# EAGLE design main (EAGLE 6.1)
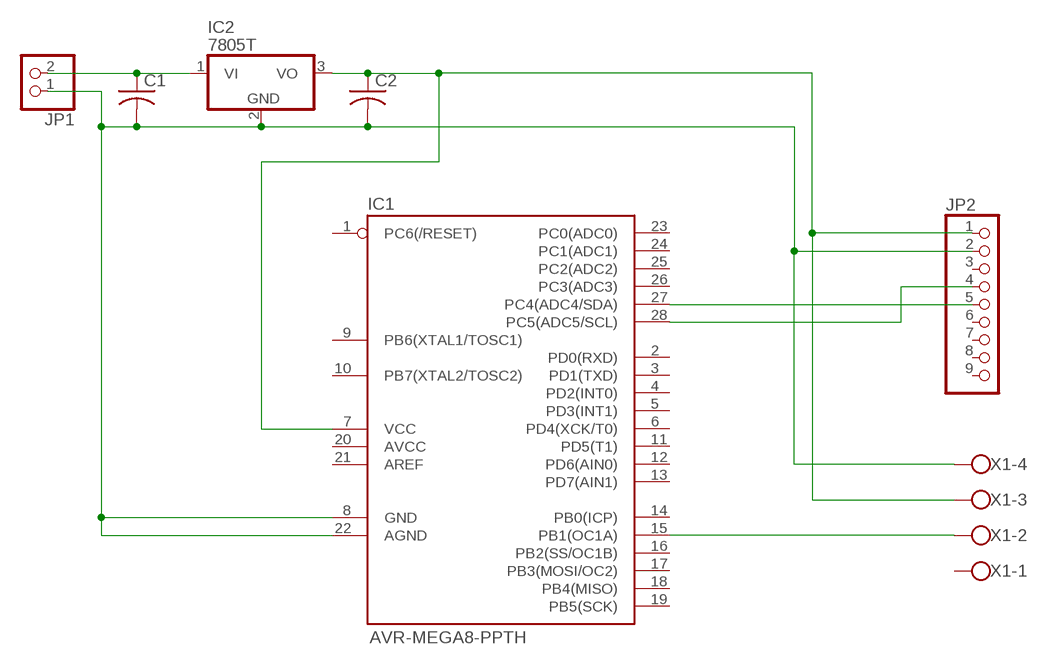
[diagram p0: schematic, sheet 1]

## Parts
C1  C-US050-075X075  [C050-075X075]
C2  C-US025-050X050  [C025-050X050]
IC1  AVR-MEGA8-PPTH  [DIL28-3]
IC2  7805T  [TO220H]
JP1  PINHD-1X2  [1X02]
JP2  PINHD-1X9  [1X09]
X1  W237-4  [W237-4]

## Nets
N$1: C1.1 IC2.1(VI) JP1.2
N$2: C1.2 C2.2 IC1.8(GND) IC1.22(AGND) IC2.2(GND) JP1.1 JP2.2 X1.4
N$3: C2.1 IC1.7(VCC) IC2.3(VO) JP2.1 X1.3
N$4: IC1.28(PC5(ADC5/SCL)) JP2.4
N$5: IC1.27(PC4(ADC4/SDA)) JP2.5
N$6: IC1.15(PB1(OC1A)) X1.2
Unconnected: IC1.1(PC6(/RESET)) IC1.2(PD0(RXD)) IC1.3(PD1(TXD)) IC1.4(PD2(INT0)) IC1.5(PD3(INT1)) IC1.6(PD4(XCK/T0)) IC1.9(PB6(XTAL1/TOSC1)) IC1.10(PB7(XTAL2/TOSC2)) IC1.11(PD5(T1)) IC1.12(PD6(AIN0)) IC1.13(PD7(AIN1)) IC1.14(PB0(ICP)) IC1.16(PB2(SS/OC1B)) IC1.17(PB3(MOSI/OC2)) IC1.18(PB4(MISO)) IC1.19(PB5(SCK)) IC1.20(AVCC) IC1.21(AREF) IC1.23(PC0(ADC0)) IC1.24(PC1(ADC1)) IC1.25(PC2(ADC2)) IC1.26(PC3(ADC3)) JP2.3 JP2.6 JP2.7 JP2.8 JP2.9 X1.1

## Library data of the parts
C1 C2 = rcl:C-US: CAPACITOR, American symbol
IC1 = SparkFun:AVR-MEGA8-P: MICROCONTROLLER 8 Kbytes FLASH 1 kbytes SRAM 512 bytes EEPROM USART 4-channel 10 bit ADC 2-channel 8 bit ADC
IC2 = linear:78*: Positive VOLTAGE REGULATOR Source: http://cache.national.com/ds/LM/LM78L05.pdf http://www.fairchildsemi.com/ds/LM/LM7805.pdf
JP1 = pinhead:PINHD-1X2: PIN HEADER
JP2 = pinhead:PINHD-1X9: PIN HEADER
X1 = con-wago-500:W237-4: WAGO SCREW CLAMP; OC_FARNELL: unknown; OC_NEWARK: unknown

## Board
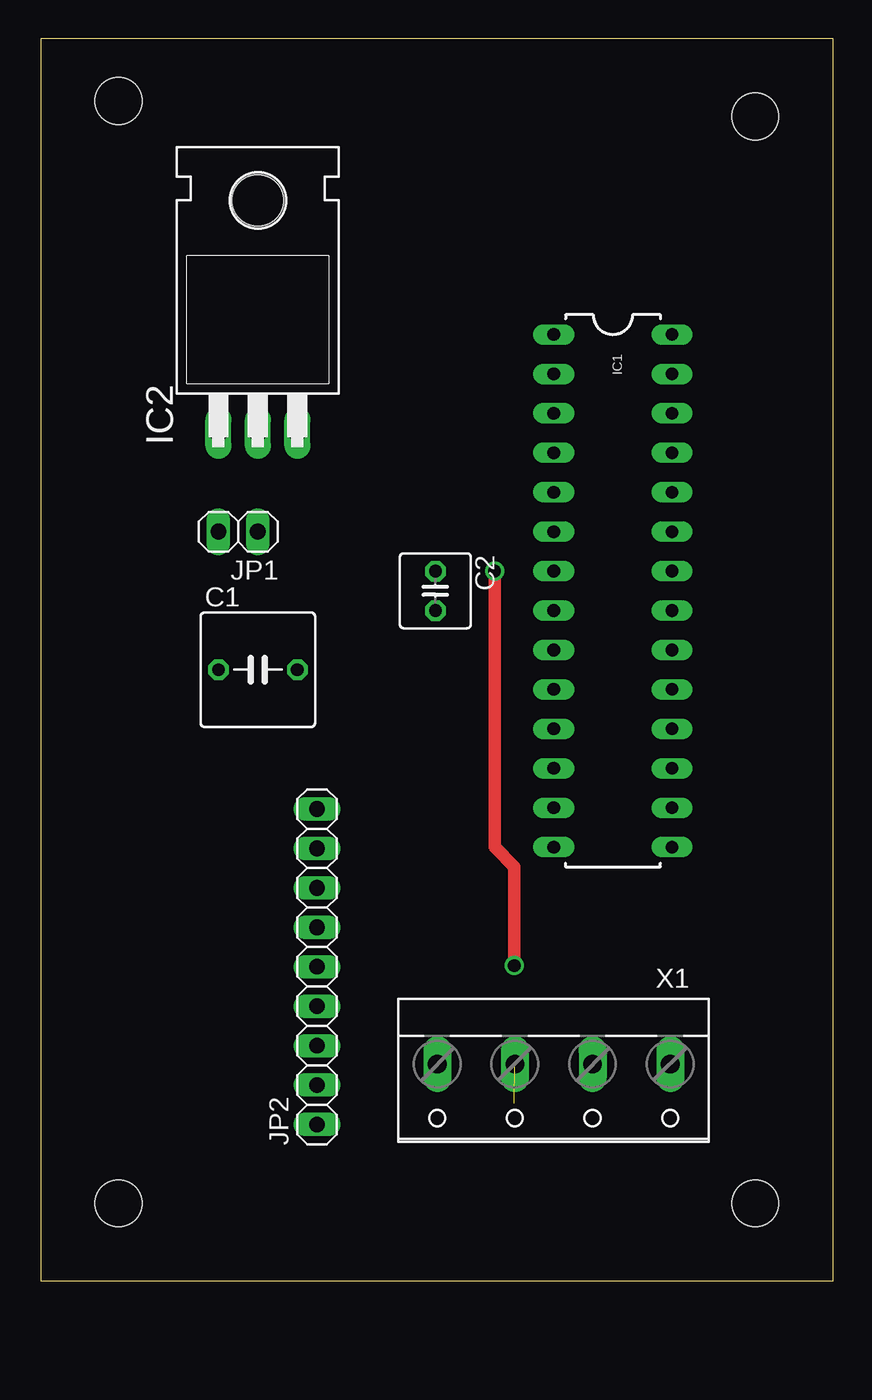
[diagram p1: board, top side]
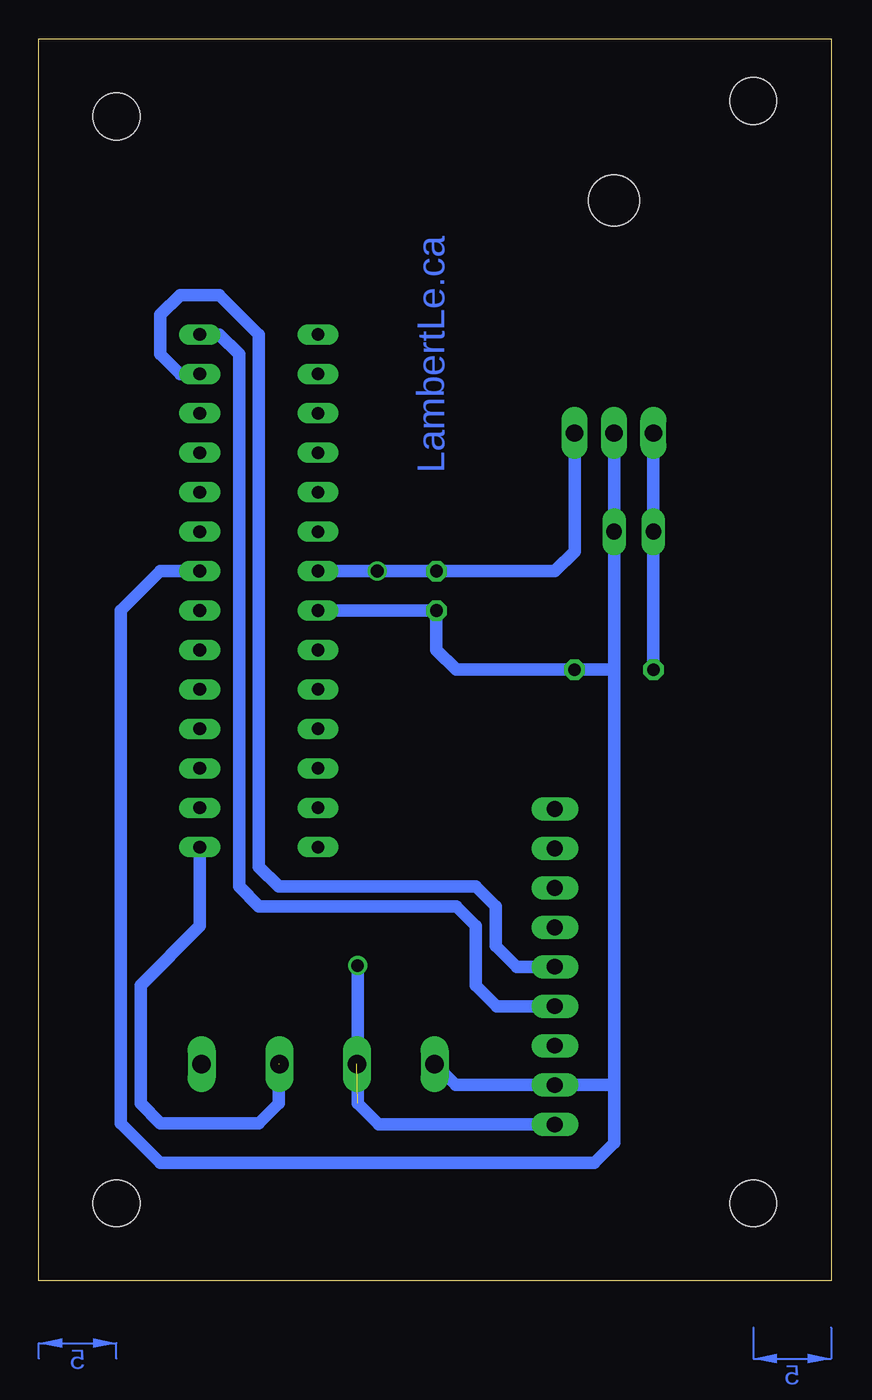
[diagram p2: board, bottom side, seen from below]

Size 51 x 80 mm. Coordinates in mm from the lower left corner, seen from the top.
Outline: 0,0 51,0 51,80 0,80 0,0
Copper layers (1*16): Top 0.035mm / dielectric 1.5mm / Bottom 0.035mm
Design rules: minimum track width 10mil, minimum drill 24mil, track to track 8mil, track to pad 8mil, pad to pad 8mil, via to via 8mil, smd to smd 8mil, copper to edge 40mil, drill to drill 8mil, minimum pad ring 10mil, minimum via ring 8mil, stop-mask expansion 4mil, vias tented up to drill 0mil, thermal gap 10mil
Holes 3 mm at 5,5 46,5 46,75 5,76

### Footprints (pad centres in the part's own frame; a part is rotated, then mirrored left to right if it is on the bottom)
C050-075X075 = drill 0.813 octagon: 1 -2.54,0; 2 2.54,0
C025-050X050 = drill 0.813 octagon: 1 -1.27,0; 2 1.27,0
DIL28-3 = drill 0.813 long: 1 -16.51,-3.81; 2 -13.97,-3.81; 3 -11.43,-3.81; 4 -8.89,-3.81; 5 -6.35,-3.81; 6 -3.81,-3.81; 7 -1.27,-3.81; 8 1.27,-3.81; 9 3.81,-3.81; 10 6.35,-3.81; 11 8.89,-3.81; 12 11.43,-3.81; 13 13.97,-3.81; 14 16.51,-3.81; 15 16.51,3.81; 16 13.97,3.81; 17 11.43,3.81; 18 8.89,3.81; 19 6.35,3.81; 20 3.81,3.81; 21 1.27,3.81; 22 -1.27,3.81; 23 -3.81,3.81; 24 -6.35,3.81; 25 -8.89,3.81; 26 -11.43,3.81; 27 -13.97,3.81; 28 -16.51,3.81
TO220H = drill 1.118 long: 1 -2.54,-10.16; 2 0,-10.16; 3 2.54,-10.16 | hole 3.302: 0,4.826
1X02 = drill 1.016 long: 1 -1.27,0; 2 1.27,0
1X09 = drill 1.016 long: 1 -10.16,0; 2 -7.62,0; 3 -5.08,0; 4 -2.54,0; 5 0,0; 6 2.54,0; 7 5.08,0; 8 7.62,0; 9 10.16,0
W237-4 = drill 1.194 long: 1 -7.5,-1.27; 2 -2.5,-1.27; 3 2.5,-1.27; 4 7.5,-1.27

### Placement (x,y rotation side)
C1  13.97,39.37 0 top
C2  25.4,44.45 270 top
IC1  36.83,44.45 270 top
IC2  13.97,64.77 0 top
JP1  12.7,48.26 180 top
JP2  17.78,20.24 90 top
X1  33.02,12.7 180 top

### Tracks (layer width: path | path; a pad name or v marks a point on that pad's centre or on a via)
N$1
  Bottom 0.813: IC2.1 JP1.2 C1.1
N$2
  Bottom 0.813: IC2.2 JP1.1 13.97,39.37 | IC1.8 C2.2 25.4,40.64 24.13,39.37 C1.2 13.97,39.37 | X1.4 24.17,12.62 JP2.2 14.05,12.62 13.97,12.7 | IC1.22 43.18,45.72 45.72,43.18 45.72,10.16 43.18,7.62 15.24,7.62 13.97,8.89 13.97,12.7 | 13.97,12.7 13.97,39.37
N$3  (via drill 0.81)  (1 unrouted)
  Top 0.813: v30.48,20.32 30.48,26.67 29.21,27.94 v29.21,45.72
  Bottom 0.813: IC2.3 16.51,46.99 17.78,45.72 C2.1 v29.21,45.72 IC1.7 | JP2.1 29.13,10.08 30.48,11.43 v30.48,20.32
N$4
  Bottom 0.813: JP2.4 21.51,17.7 22.86,19.05 22.86,22.86 24.13,24.13 36.83,24.13 38.1,25.4 38.1,59.69 39.37,60.96 IC1.28
N$5
  Bottom 0.813: JP2.5 20.24,20.24 21.59,21.59 21.59,24.13 22.86,25.4 35.56,25.4 36.83,26.67 36.83,60.96 39.37,63.5 41.91,63.5 43.18,62.23 43.18,59.69 41.91,58.42 IC1.27
N$6  (1 unrouted)
  Bottom 0.813: IC1.15 40.64,22.86 44.45,19.05 44.45,11.43 43.18,10.16 36.83,10.16 35.56,11.43 35.56,13.97
(copper drawn outside any net)
  shapes: Bottom area x9

### Text on the board
Bottom: LambertLe.ca